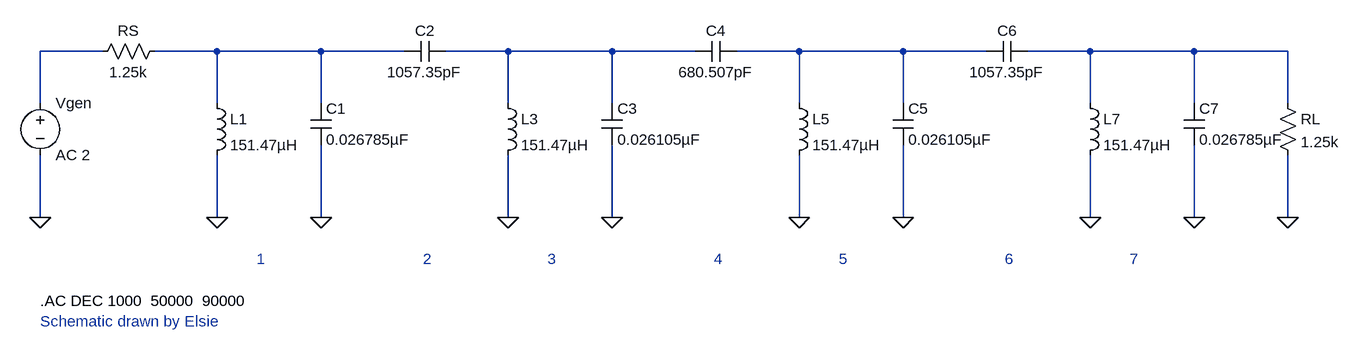
[diagram p0: schematic passe-bande-butterworth-77500Hz.asc]
passe-bande-butterworth-77500Hz.asc, the LTspice schematic file:
Version 4
SHEET 1 2192 600
WIRE 96 80 0 80
WIRE 272 80 176 80
WIRE 432 80 272 80
WIRE 560 80 432 80
WIRE 720 80 624 80
WIRE 880 80 720 80
WIRE 1008 80 880 80
WIRE 1168 80 1072 80
WIRE 1328 80 1168 80
WIRE 1456 80 1328 80
WIRE 1616 80 1520 80
WIRE 1776 80 1616 80
WIRE 1920 80 1776 80
WIRE 0 160 0 80
WIRE 272 160 272 80
WIRE 432 160 432 80
WIRE 720 160 720 80
WIRE 880 160 880 80
WIRE 1168 160 1168 80
WIRE 1328 160 1328 80
WIRE 1616 160 1616 80
WIRE 1776 160 1776 80
WIRE 1920 160 1920 80
WIRE 0 336 0 240
WIRE 272 336 272 240
WIRE 432 336 432 224
WIRE 720 336 720 240
WIRE 880 336 880 224
WIRE 1168 336 1168 240
WIRE 1328 336 1328 224
WIRE 1616 336 1616 240
WIRE 1776 336 1776 224
WIRE 1920 336 1920 240
FLAG 0 336 0
FLAG 272 336 0
FLAG 432 336 0
FLAG 720 336 0
FLAG 880 336 0
FLAG 1168 336 0
FLAG 1328 336 0
FLAG 1616 336 0
FLAG 1776 336 0
FLAG 1920 336 0
SYMBOL voltage 0 144 R0
WINDOW 123 24 132 Left 0
SYMATTR InstName Vgen
SYMATTR Value AC 2
SYMBOL res 192 64 R90
WINDOW 0 0 56 VBottom 0
WINDOW 3 32 56 VTop 0
SYMATTR InstName RS
SYMATTR Value 1.25k
SYMBOL ind 256 144 R0
SYMATTR InstName L1
SYMATTR Value 151.47µH
SYMATTR SpiceLine Rser=0.3687879
SYMBOL cap 416 160 R0
SYMATTR InstName C1
SYMATTR Value 0.026785µF
SYMATTR SpiceLine Rpar=153.338k
SYMBOL cap 624 64 R90
WINDOW 0 0 32 VBottom 0
WINDOW 3 32 32 VTop 0
SYMATTR InstName C2
SYMATTR Value 1057.35pF
SYMATTR SpiceLine Rpar=3.884Meg
SYMBOL ind 704 144 R0
SYMATTR InstName L3
SYMATTR Value 151.47µH
SYMATTR SpiceLine Rser=0.3687879
SYMBOL cap 864 160 R0
SYMATTR InstName C3
SYMATTR Value 0.026105µF
SYMATTR SpiceLine Rpar=157.336k
SYMBOL cap 1072 64 R90
WINDOW 0 0 32 VBottom 0
WINDOW 3 32 32 VTop 0
SYMATTR InstName C4
SYMATTR Value 680.507pF
SYMATTR SpiceLine Rpar=6.036Meg
SYMBOL ind 1152 144 R0
SYMATTR InstName L5
SYMATTR Value 151.47µH
SYMATTR SpiceLine Rser=0.3687879
SYMBOL cap 1312 160 R0
SYMATTR InstName C5
SYMATTR Value 0.026105µF
SYMATTR SpiceLine Rpar=157.336k
SYMBOL cap 1520 64 R90
WINDOW 0 0 32 VBottom 0
WINDOW 3 32 32 VTop 0
SYMATTR InstName C6
SYMATTR Value 1057.35pF
SYMATTR SpiceLine Rpar=3.884Meg
SYMBOL ind 1600 144 R0
SYMATTR InstName L7
SYMATTR Value 151.47µH
SYMATTR SpiceLine Rser=0.3687879
SYMBOL cap 1760 160 R0
SYMATTR InstName C7
SYMATTR Value 0.026785µF
SYMATTR SpiceLine Rpar=153.338k
SYMBOL res 1904 144 R0
SYMATTR InstName RL
SYMATTR Value 1.25k
TEXT 0 464 Left 0 !.AC DEC 1000  50000  90000
TEXT 0 496 Left 0 ;Schematic drawn by Elsie
TEXT 336 400 Center 0 ; 1
TEXT 592 400 Center 0 ; 2
TEXT 784 400 Center 0 ; 3
TEXT 1040 400 Center 0 ; 4
TEXT 1232 400 Center 0 ; 5
TEXT 1488 400 Center 0 ; 6
TEXT 1680 400 Center 0 ; 7

The netlist it stands for:
* passe-bande-butterworth-77500Hz.asc
Vgen N001 0 AC 2
RS N002 N001 1.25k
L1 N002 0 151.47µH Rser=0.3687879
C1 N002 0 0.026785µF Rpar=153.338k
C2 N003 N002 1057.35pF Rpar=3.884Meg
L3 N003 0 151.47µH Rser=0.3687879
C3 N003 0 0.026105µF Rpar=157.336k
C4 N004 N003 680.507pF Rpar=6.036Meg
L5 N004 0 151.47µH Rser=0.3687879
C5 N004 0 0.026105µF Rpar=157.336k
C6 N005 N004 1057.35pF Rpar=3.884Meg
L7 N005 0 151.47µH Rser=0.3687879
C7 N005 0 0.026785µF Rpar=153.338k
RL N005 0 1.25k
.AC DEC 1000  50000  90000
* Schematic drawn by Elsie
*  1
*  2
*  3
*  4
*  5
*  6
*  7
.backanno
.end